# EAGLE design board (EAGLE 9.3.0)
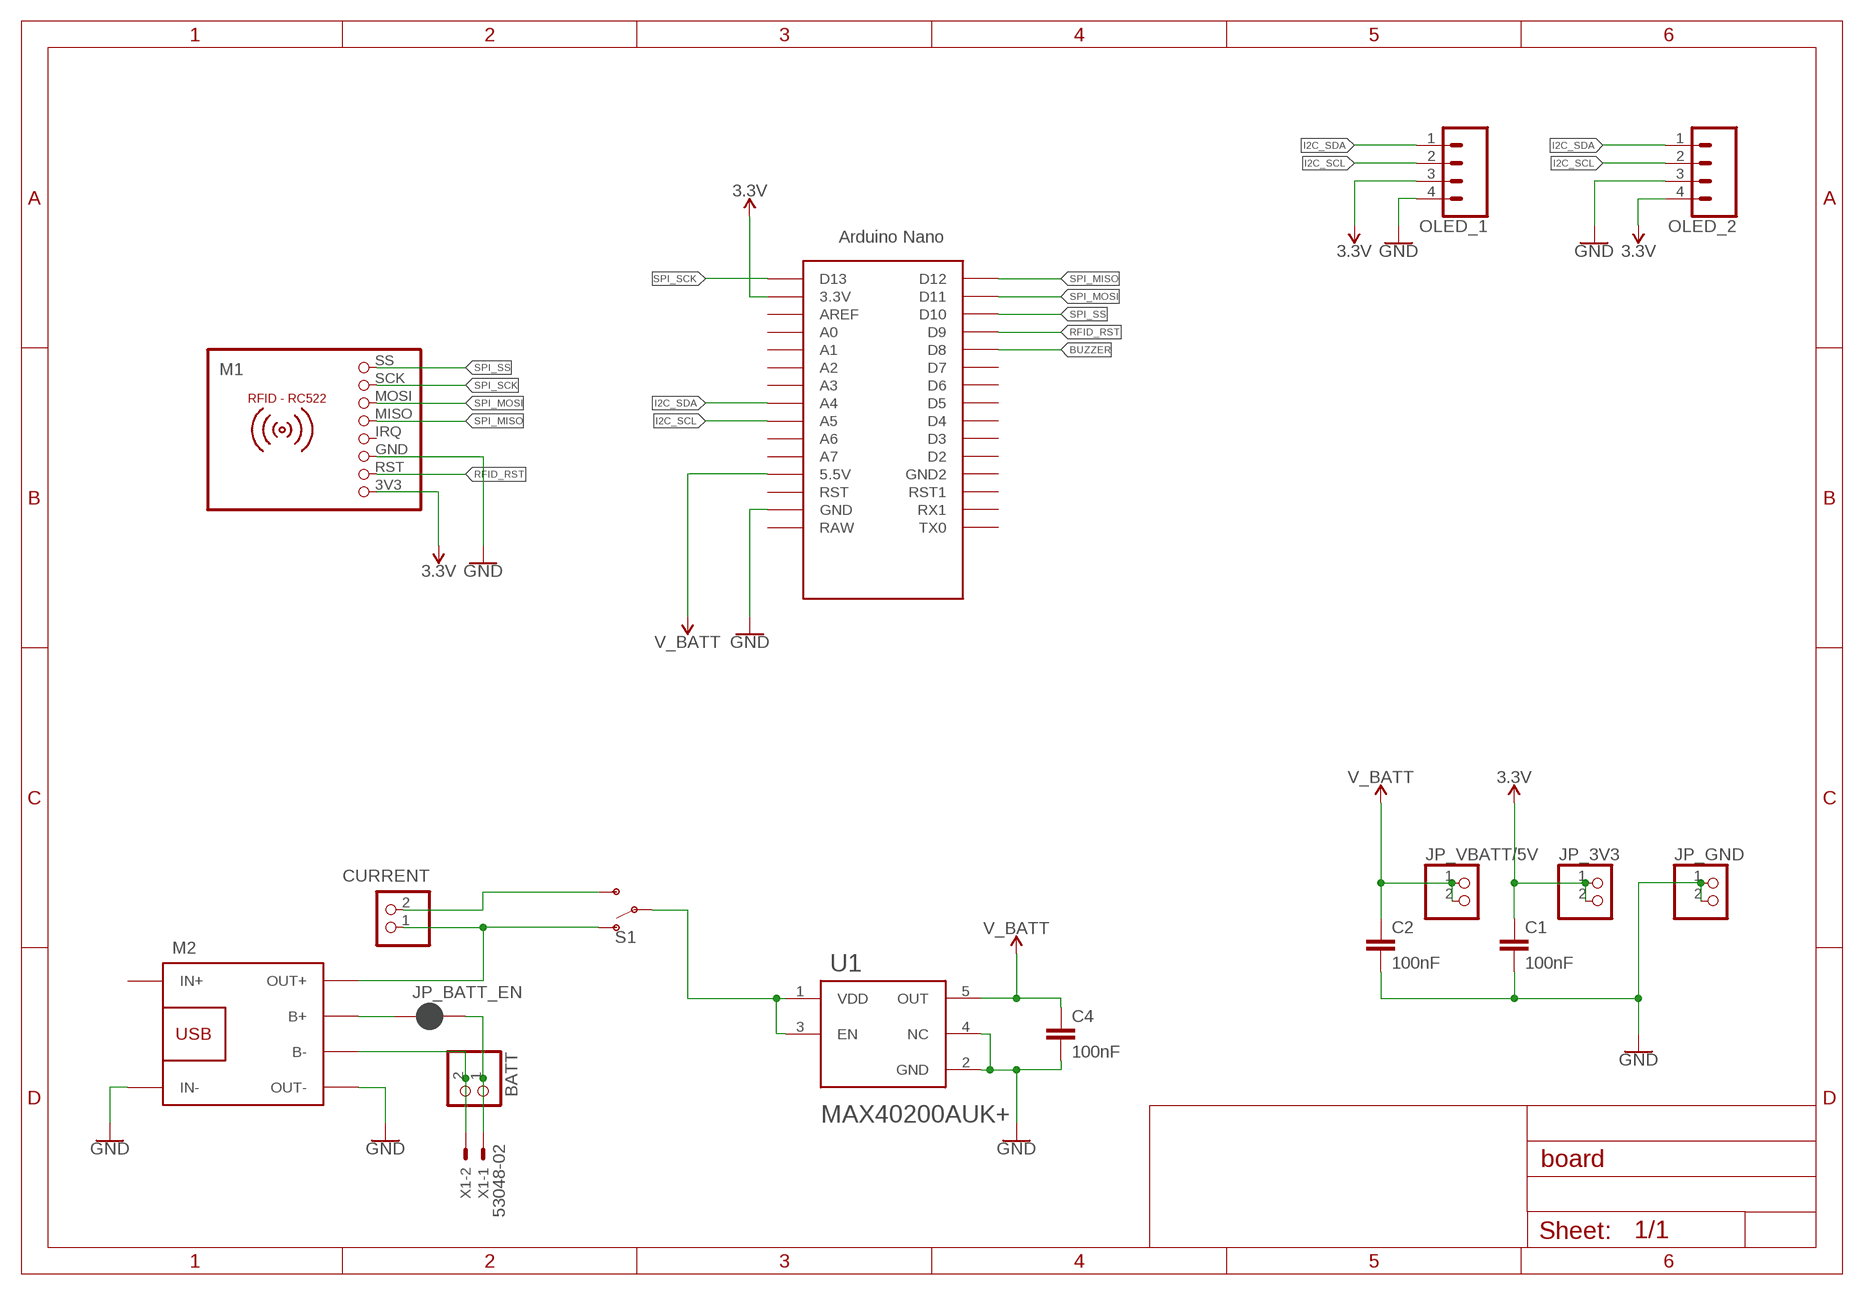
[diagram p0: schematic, sheet 1]

## Parts
BATT  PINHD-1X2  [1X02]
C1  100nF  C-EUC0805  [C0805]
C2  100nF  C-EUC0805  [C0805]
C4  100nF  C-EUC0805  [C0805]
CURRENT  PINHD-1X2  [1X02]
JP_3V3  PINHD-1X2  [1X02]
JP_BATT_EN  JUMPER-SMT_2_NC_PASTE_SILK  [SMT-JUMPER_2_NC_PASTE_SILK]
JP_GND  PINHD-1X2  [1X02]
JP_VBATT/5V  PINHD-1X2  [1X02]
M1  RFID-RC522  [RFID-RC522]
M2  BATTERY-CHARGER-LI-PROT  [BATTERY-CHARGER-LI-PROT]
OLED_1  CONN_04  [1X04]
OLED_2  CONN_04  [1X04]
S1  SWITCH-SPDT-PTH-11.6X4.0MM  [SWITCH_SPDT_PTH_11.6X4.0MM]
U1  MAXIM_ELECTRONICS_MAX40200AUK+MAXIM_ELECTRONICS_MAX40200AUK+_0_0  [MAXIM_ELECTRONICS_MAX40200AUK+_0]
U$1  NANO_ICSP-REMOVED  [NANO_ICSP-REMOVED]
X1  53048-02  [53048-02]

## Nets
3.3V [power]: C1.1 JP_3V3.1 JP_3V3.2 M1.3V3 OLED_1.3 OLED_2.4 U$1.3.3V
BATT_VOUT [power]: S1.2(P) U1.1(VDD) U1.3(EN)
BUZZER: U$1.D8
GND [power]: C1.2 C2.2 C4.2 JP_GND.1 JP_GND.2 M1.GND M2.IN- M2.OUT- OLED_1.4 OLED_2.3 U1.2(GND) U1.4(NC) U$1.GND
I2C_SCL: OLED_1.2 OLED_2.2 U$1.A5
I2C_SDA: OLED_1.1 OLED_2.1 U$1.A4
N$2 [power]: CURRENT.1 M2.OUT+ S1.1(O)
N$3 [power]: BATT.1 JP_BATT_EN.2 X1.1
N$4 [power]: CURRENT.2 S1.3(S)
N$5 [power]: BATT.2 M2.B- X1.2
N$6 [power]: JP_BATT_EN.1 M2.B+
RFID_RST: M1.RST U$1.D9
SPI_MISO: M1.MISO U$1.D12
SPI_MOSI: M1.MOSI U$1.D11
SPI_SCK: M1.SCK U$1.D13
SPI_SS: M1.SS U$1.D10
V_BATT [power]: C2.1 C4.1 JP_VBATT/5V.1 JP_VBATT/5V.2 U1.5(OUT) U$1.5V(5.5V)
Unconnected: M1.IRQ M2.IN+ U$1.A0 U$1.A1 U$1.A2 U$1.A3 U$1.A6 U$1.A7 U$1.AREF U$1.D2 U$1.D3 U$1.D4 U$1.D5 U$1.D6 U$1.D7 U$1.GND1(GND2) U$1.RAW U$1.RST U$1.RST1 U$1.RX1 U$1.TX0

## Library data of the parts
BATT CURRENT JP_3V3 JP_GND JP_VBATT/5V = pinhead:PINHD-1X2: PIN HEADER
C1 C2 C4 = rcl:C-EU: CAPACITOR, European symbol; SPICEPREFIX: C
JP_BATT_EN = SparkFun-Jumpers:JUMPER-SMT_2_NC_PASTE: Normally closed solder jumper This jumper has an aperture in the stencil to allow solder paste to bridge the split in the wire so it's normally closed (NC). Wick off the solder to open the connection. Reapply solder to reclose the connection.
M1 = mfrc522-module:RFID-RC522: RFID-RC522 MFRC-522 based breakout board
M2 = diy-modules:BATTERY-CHARGER-LI-PROT: Lithium Battery 5V Charger with protection circuit More details available here: http://www.instructables.com/id/DIY-Lithium-ion-Battery-Charger/step4/TP4056-based-lithium-ion-battery-charger-module/ Click here to find device on ebay.com <http://www.ebay.com/sch/tp4056+charger+usb+protection>
OLED_1 OLED_2 = SparkFun-Connectors:CONN_04: Multi connection point. Often used as Generic Header-pin footprint for 0.1 inch spaced/style header connections On any of the 0.1 inch spaced packages, you can populate with these: Break Away Headers - Straight <https://www.sparkfun.com/products/116> (PRT-00116) Break Away Male Headers - Right Angle <https://www.sparkfun.com/products/553> (PRT-00553) Female Headers <https://www.sparkfun.com/products/115> (PRT-00115) Break Away Headers - Machine Pin <https://www.sparkfun.com/products/117> (PRT-00117) Break Away Female Headers - Swiss Machine Pin <https://www.sparkfun.com/products/743> (PRT-00743) For SCREWTERMINALS and SPRING TERMINALS visit here: Screw Terimnals on SparkFun.com <https://www.sparkfun.com/search/results?term=Screw+Terminals> (5mm/3.5mm/2.54mm spacing) This device is also useful as a general connection point to wire up your design to another part of your project. Our various solder wires solder well into these plated through hole pads. Hook-Up Wire - Assortment (Stranded, 22 AWG) <https://www.sparkfun.com/products/11375> (PRT-11375) Hook-Up Wire - Assortment (Solid Core, 22 AWG) <https://www.sparkfun.com/products/11367> (PRT-11367) View the entire wire category on our website here <https://www.sparkfun.com/categories/141> Special notes: Molex polarized connector foot print use with SKU : PRT-08231 with associated crimp pins and housings. 1MM SMD Version SKU: PRT-10208; PROD_ID: CONN-09696
S1 = SparkFun-Switches:SWITCH-SPDT: Single Pole, Double Throw (SPDT) Switch Single-pole, double-throw (SPDT) switch. Variant Overview SMD-AYZ0202 Surface Mount DPDT Switch <https://www.sparkfun.com/products/597> (COM-00597) Used on e.g. LilyPad Arduino USB - ATmega32U4 Board <https://www.sparkfun.com/products/12049> PTH-11.6X4.0MM SPDT Mini Power Switch <https://www.sparkfun.com/products/102> (COM-00102) Used on e.g. SparkFun Simon Says - Through-Hole Soldering Kit <https://www.sparkfun.com/products/10547> (KIT-10547) PTH-11.6X4.0MM-KIT KIT version of SPDT Mini Power Switch - Simplifies soldering by removing tStop of switch pins - only one side can be soldered. PTH-11.6X4.0MM-LOCK LOCK version of SPDT Mini Power Switch - Offset pins hold switch in place for easier soldering. SMD-RIGHT-ANGLE Surface Mount Right Angle Switch <https://www.sparkfun.com/products/10860> (COM-10860) Used on e.g. SparkFun ESP8266 Thing <https://www.sparkfun.com/products/13231>; PROD_ID: SWCH-08261; SF_SKU: COM-00102
U1 = Maxim Electronics - MAX40200AUK+:MAXIM_ELECTRONICS_MAX40200AUK+: IDEAL DIODE CURRENT SW, 5.5V, SOT23-5; CENTROID_NOT_SPECIFIED: No; DATASHEET: https://datasheets.maximintegrated.com/en/ds/MAX40200.pdf; DEVICE_CLASS_L1: Integrated Circuits (ICs); DEVICE_CLASS_L2: Power Management ICs; DEVICE_CLASS_L3: unset; DIGIKEY_DESCRIPTION: IC DIODE CURRENT SWITCH SOT23-5; DIGIKEY_PART_NUMBER: MAX40200AUK+-ND; FOOTPRINT_URL: https://pdfserv.maximintegrated.com/land_patterns/90-0174.PDF; HEIGHT: 1.45mm; LEAD_FREE: yes; MAX_JUNCTION_TEMP: +150°C; MAX_POWER_DISSIPATION: 312.6mW; MAX_SUPPLY_VOLTAGE: 5.5V; MF: Maxim Electronics; MFG_PACKAGE_IDENT: U5-1; MFG_PACKAGE_IDENT_DATE: 0; MFG_PACKAGE_IDENT_REV: J; MIN_SUPPLY_VOLTAGE: 1.5V; MOUSER_PART_NUMBER: 700-MAX40200AUK+; MPN: MAX40200AUK+; NOMINAL_SUPPLY_CURRENT: 7uA; NUMBER_OF_OUTPUTS: 1; OUTPUT_CURRENT: 1A; PACKAGE: SOT23-5; PREFIX: U; ROHS: yes; STANDOFF_HEIGHT: 0mm; TEMPERATURE_RANGE_HIGH: +125°C; TEMPERATURE_RANGE_LOW: -40°C; VERIFICATION_VERSION: 0.0.0.1
U$1 = Arduino-clone:NANO_ICSP-REMOVED
X1 = con-molex:53?-02: CONNECTOR wire to board 1.25 mm (.049 inch) pitch header; MF: MOLEX; MPN: 53048-0210; OC_FARNELL: 1012259; OC_NEWARK: 57H4718

## Module BUZZER
Ports: 

### Library data of the parts

## Net classes
1 power: width 0.914 mm, clearance 0.254 mm

## Board
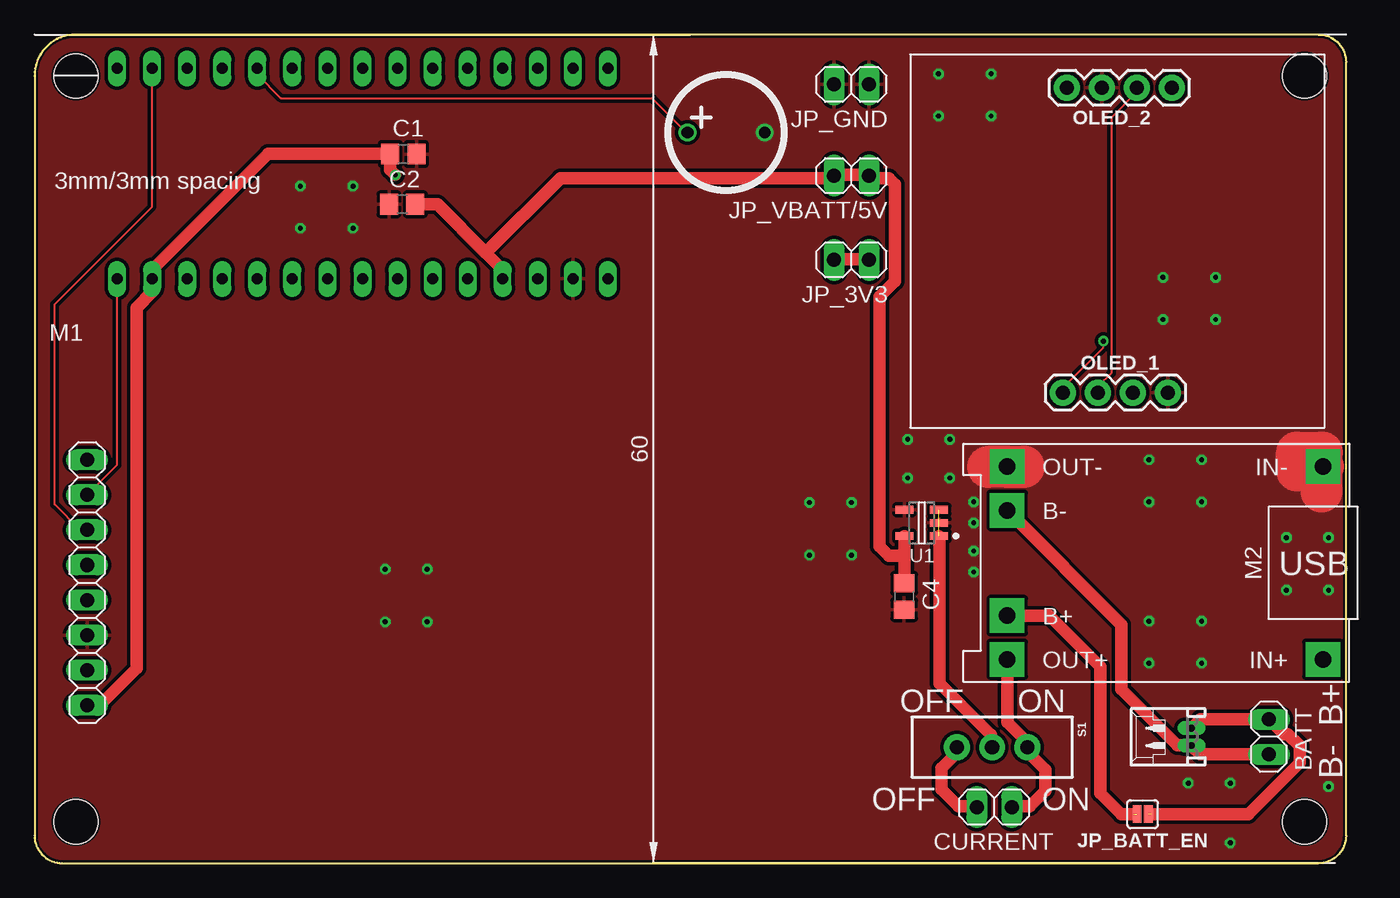
[diagram p1: board, top side]
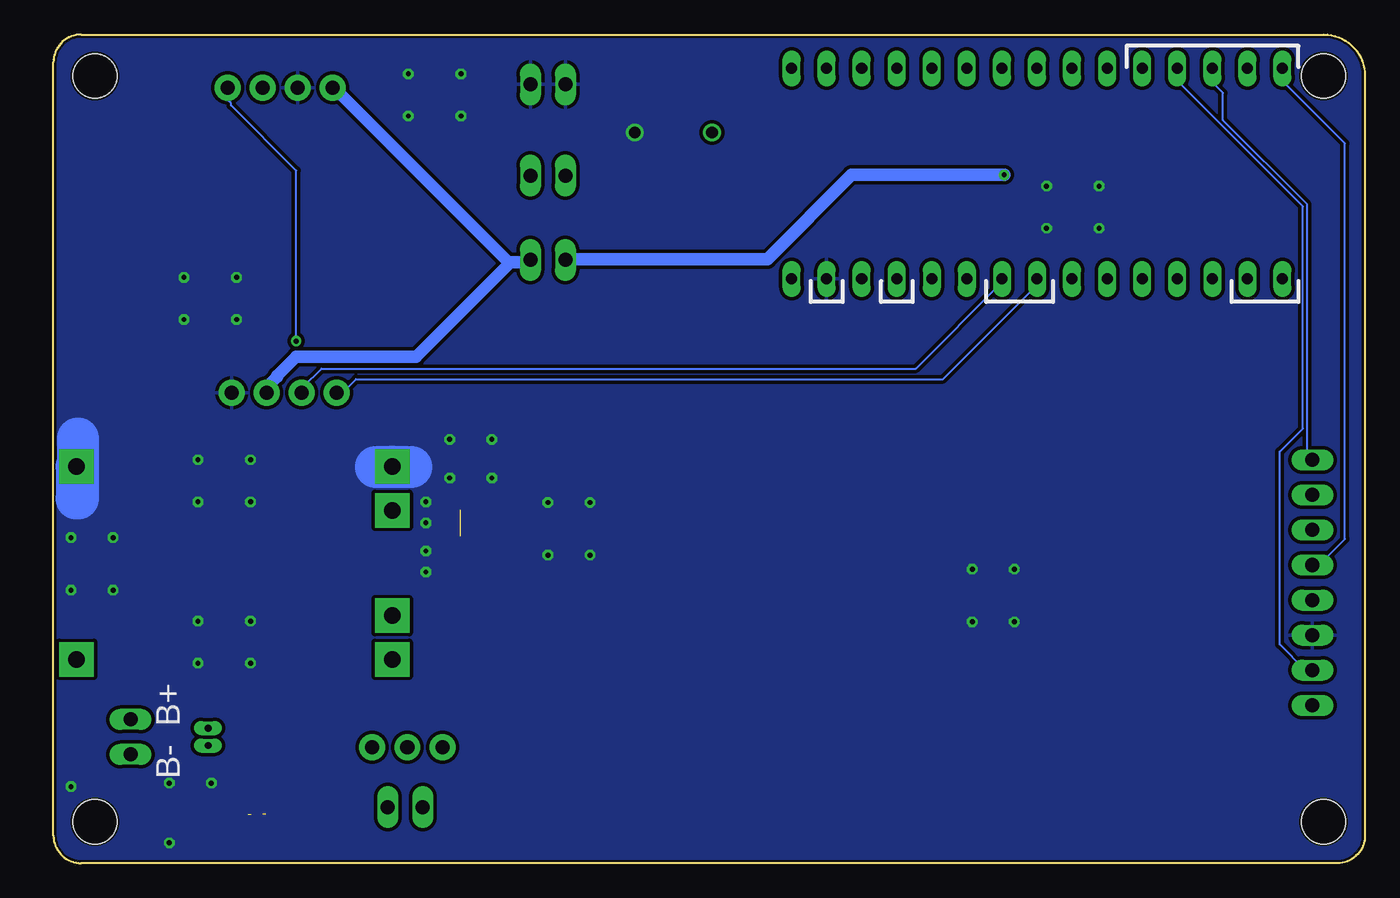
[diagram p2: board, bottom side, seen from below]

Size 95 x 60 mm. Coordinates in mm from the lower left corner, seen from the top.
Outline: 2,0 93,0 arc90 95,2 95,58 arc90 93,60 3,60 arc90 0,57 0,2 arc90 2,0
Copper layers (1*16): Top 0.035mm / dielectric 1.5mm / Bottom 0.035mm
Design rules "default *": minimum track width 6mil, minimum drill 0.35mm, track to track 6mil, track to pad 6mil, pad to pad 6mil, via to via 6mil, smd to smd 6mil, copper to edge 6mil, drill to drill 6mil, minimum pad ring 10mil, minimum via ring 8mil, stop-mask expansion 4mil, vias tented up to drill 0mil, thermal gap 10mil
Holes 3.2 mm at 3,57 3,3 92,3 92,57

### Footprints (pad centres in the part's own frame; a part is rotated, then mirrored left to right if it is on the bottom)
1X02 = drill 1.016 long: 1 -1.27,0; 2 1.27,0
C0805 = smd 1.3 x 1.5: 1 -0.95,0; 2 0.95,0
SMT-JUMPER_2_NC_PASTE_SILK = smd 0.635 x 1.27: 1 -0.406,0; 2 0.406,0
RFID-RC522 = drill 1.016 long: 3V3 -8.89,0; GND -3.81,0; IRQ -1.27,0; MISO 1.27,0; MOSI 3.81,0; RST -6.35,0; SCK 6.35,0; SS 8.89,0
BATTERY-CHARGER-LI-PROT = drill 1.2 pad 2.5 square: B+ 10.795,3.81; B- 10.795,-3.81; IN+ -12.065,6.985; IN- -12.065,-6.985; OUT+ 10.795,6.985; OUT- 10.795,-6.985
1X04 = drill 1.016 pad 1.88: 1 0,0; 2 2.54,0; 3 5.08,0; 4 7.62,0
SWITCH_SPDT_PTH_11.6X4.0MM = drill 1.016 pad 1.88: 1 0,2.54; 2 0,0; 3 0,-2.54
MAXIM_ELECTRONICS_MAX40200AUK+_0 = smd 1.3 x 0.55: 1 -1.25,0.95; 2 -1.25,0; 3 -1.25,-0.95; 4 1.25,-0.95; 5 1.25,0.95
NANO_ICSP-REMOVED = drill 0.8 long: 3.3V -10.16,24.13; 5V -10.16,-1.27; A0 -10.16,19.05; A1 -10.16,16.51; A2 -10.16,13.97; A3 -10.16,11.43; A4 -10.16,8.89; A5 -10.16,6.35; A6 -10.16,3.81; A7 -10.16,1.27; AREF -10.16,21.59; D2 5.08,1.27; D3 5.08,3.81; D4 5.08,6.35; D5 5.08,8.89; D6 5.08,11.43; D7 5.08,13.97; D8 5.08,16.51; D9 5.08,19.05; D10 5.08,21.59; D11 5.08,24.13; D12 5.08,26.67; D13 -10.16,26.67; GND -10.16,-6.35; GND1 5.08,-1.27; RAW -10.16,-8.89; RST -10.16,-3.81; RST1 5.08,-3.81; RX1 5.08,-6.35; TX0 5.08,-8.89
53048-02 = drill 0.5 pad 0.698 long: 1 0.625,-1.25; 2 -0.625,-1.25

### Placement (x,y rotation side)
BATT  89.41,9.14 270 top
C1  26.71,51.35 0 top
C2  26.63,47.71 180 top
C4  62.99,19.3 270 top
CURRENT  69.52,4.06 180 top
JP_3V3  59.18,43.69 180 top
JP_BATT_EN  80.26,3.56 0 top
JP_GND  59.18,56.39 180 top
JP_VBATT/5V  59.18,49.78 180 top
M1  3.81,20.32 90 top
M2  81.26,21.74 180 top
OLED_1  74.48,34.08 0 top
OLED_2  82.38,56.15 180 top
S1  69.36,8.4 270 top
U1  64.26,24.64 180 top
U$1  32.65,52.47 90 top
X1  82.55,9.14 90 top

### Tracks (layer width: path | path; a pad name or v marks a point on that pad's centre or on a via)
3.3V  (via drill 0.35)
  Top 0.914: JP_3V3.2 57.91,43.74 60.43,43.74 JP_3V3.1 | M1.3V3 4.72,11.43 7.39,14.1 7.39,40.23 8.53,41.38 8.53,41.83 U$1.3.3V 8.53,42.37 8.53,42.98 16.92,51.36 C1.1 25.76,50.9 25.76,50.22 v26.14,49.84
  Bottom 0.914: 61.95,43.43 61.87,43.51 60.66,43.51 60.5,43.66 JP_3V3.1 | 61.95,43.43 68.73,36.65 77.42,36.65 78.79,35.28 78.79,35.2 79.55,34.44 79.55,34.14 OLED_1.3 | 61.95,43.43 74.6,56.08 74.75,56.08 OLED_2.4 | v26.14,49.84 37.19,49.84 43.28,43.74 57.91,43.74 JP_3V3.2
BATT_VOUT  (1 unrouted)
  Top 0.914: U1.1 65.53,23.62 65.53,13.03 69.27,9.3 69.27,9.14 69.49,8.91 69.49,8.53 69.42,8.46 S1.2
BUZZER  (via drill 0.85)
  Top 0.152: v47.3,52.91 47.24,52.96 46.94,53.26 46.86,53.26 44.73,55.4 17.83,55.4 16.15,57.07 16.15,57.53 U$1.D8
GND  (via drill 0.35, 0.85)
  Top 3.048: M2.IN- 91.44,28.72 | 91.44,28.72 91.44,28.45 | 91.44,28.72 91.44,29.72 93.22,29.72 | 93.25,29.72 93.22,29.72 | 93.22,29.72 93.22,26.92 | 71.63,28.68 71.63,28.72 M2.OUT- 70.46,28.7 69.09,28.7
  Bottom 3.048: M2.IN- 93.32,26.42 93.22,26.42 93.22,30.73 | 71.63,28.7 70.46,28.7 | M2.OUT- 70.46,28.7 | 70.46,28.7 69.09,28.7
  other vias: 52.9,52.91 59.18,22.3 59.18,26.11 56.13,22.3 56.13,26.11 80.72,14.48 84.53,14.48 80.72,17.53 84.53,17.53 80.72,26.16 84.53,26.16 80.72,29.21 84.53,29.21 93.73,5.54 86.61,5.79 86.61,1.48 83.57,5.79 19.26,45.97 23.07,45.97 19.26,49.02 23.07,49.02 65.48,54.1 69.29,54.1 65.48,57.15 69.29,57.15 81.74,39.37 85.55,39.37 81.74,42.42 85.55,42.42 93.73,19.76 93.73,23.57 90.68,19.76 90.68,23.57 66.29,27.89 66.29,30.69 63.25,27.89 63.25,30.69 68.02,21.08 68.02,22.61 68.02,24.64 68.02,26.16 28.45,17.48 28.45,21.29 25.4,17.48 25.4,21.29
  pour Top: -5.08,66.04 102.06,66.04 102.06,-5.08 -5.08,-5.08
  pour Bottom: -5.08,66.04 102.06,66.04 102.06,-5.08 -5.08,-5.08
I2C_SCL
  Top 0.152: OLED_2.2 79.78,56.08 79.78,55.78 78.03,54.03 78.03,35.51 77.04,34.52 77.04,34.14 OLED_1.2
  Bottom 0.152: U$1.A5 26.36,42.29 26.36,41.99 32.54,35.81 75.59,35.81 76.96,34.44 76.96,34.14 OLED_1.2
I2C_SDA  (via drill 0.35)
  Top 0.152: v77.42,37.8 77.42,37.34 74.52,34.44 74.52,34.14 OLED_1.1
  Bottom 0.152: U$1.A4 23.77,42.29 23.77,41.83 30.56,35.05 73.08,35.05 73.99,34.14 74.45,34.14 OLED_1.1 | v77.42,37.8 77.42,50.14 82.14,54.86 82.14,55.02 82.37,55.24 82.37,56.08 OLED_2.1
N$2
  Top 0.914: CURRENT.1 70.79,4.12 72.08,4.12 73.23,5.26 73.23,6.78 71.93,8.08 71.93,8.38 S1.1 71.78,8.76 71.78,8.91 70.48,10.21 70.48,14.71 M2.OUT+
N$3  (1 unrouted)
  Top 0.914: X1.1 84.44,10.41 BATT.1 90.47,9.35 90.78,9.35 91.64,8.48 91.64,7.26 87.94,3.56 80.89,3.56
N$4
  Top 0.914: CURRENT.2 68.2,4.12 66.9,4.12 65.68,5.33 65.68,6.86 66.75,7.92 66.75,8.38 S1.3
N$5
  Top 0.914: BATT.2 84.44,7.87 X1.2 83.77,8.55 82.79,8.55 78.74,12.61 78.74,17.27 M2.B-
N$6  (1 unrouted)
  Top 0.914: 79.64,3.56 78.74,3.56 77.22,5.08 77.22,14.22 73.51,17.93 M2.B+
RFID_RST
  Bottom 0.152: U$1.D9 13.56,57.53 13.56,56.62 4.5,47.55 4.5,31.47 6.17,29.79 6.17,15.85 4.34,14.02 3.81,14.02 M1.RST
SPI_MISO
  Bottom 0.152: U$1.D12 5.94,57.53 5.94,56.62 1.45,52.12 1.45,23.47 3.28,21.64 3.81,21.64 M1.MISO
SPI_MOSI
  Top 0.152: M1.MOSI 3.81,24.16 3.28,24.16 1.45,25.98 1.45,40.46 8.52,47.53 U$1.D11
SPI_SCK
  Top 0.152: M1.SCK 5.98,28.84 U$1.D13
SPI_SS
  Bottom 0.152: U$1.D10 11.05,57.53 11.05,56.54 10.29,55.78 10.29,53.8 4.19,47.7 4.19,29.64 3.81,29.26 M1.SS
V_BATT
  Top 0.914: 32.69,44.2 33.91,42.98 33.91,42.37 U$1.5V | 32.69,44.2 29.18,47.7 C2.1 | 63.02,22.25 63.02,20.27 C4.1 | 63.02,22.25 63.02,23.62 U1.5 | 63.02,22.25 61.87,22.25 61.19,22.94 61.19,41 62.33,42.14 62.33,49.15 61.87,49.61 60.66,49.61 60.5,49.76 JP_VBATT/5V.1 59.97,49.84 57.91,49.84 JP_VBATT/5V.2 57.53,49.61 38.1,49.61 32.69,44.2

### Text on the board
tPlace: 3mm/3mm spacing | OFF | ON | B+ | B- | OFF | ON
bPlace: B+ | B-